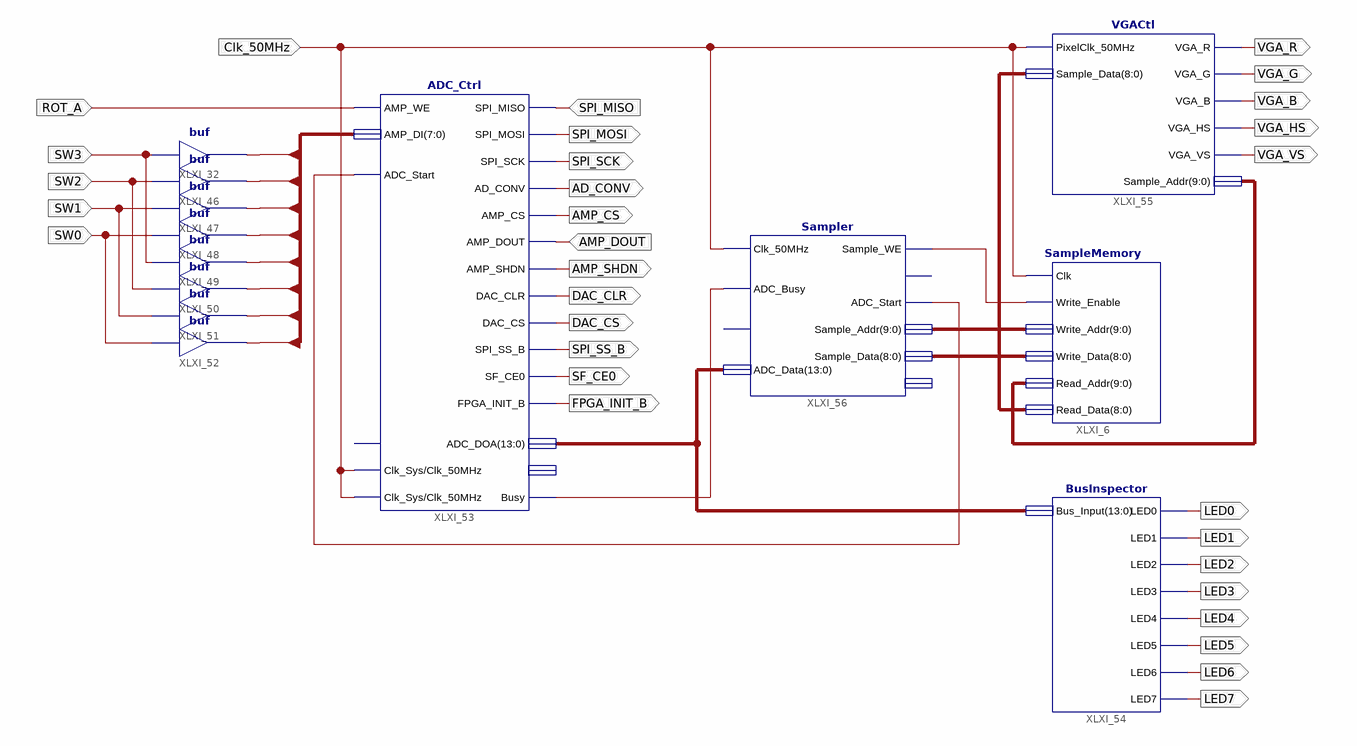
[diagram p0: schematic sheet 1]
// Xilinx ISE schematic Oscilloscope.sch (spartan3e) as structural Verilog: 13 symbols, 31 ports
module Oscilloscope (
  input  Clk_50MHz,
  input  AMP_DOUT,
  input  ROT_A,
  input  SW3,
  input  SW0,
  input  SW1,
  input  SW2,
  input  SPI_MISO,
  output SPI_MOSI,
  output SPI_SCK,
  output AD_CONV,
  output AMP_CS,
  output AMP_SHDN,
  output DAC_CLR,
  output DAC_CS,
  output SPI_SS_B,
  output FPGA_INIT_B,
  output SF_CE0,
  output LED7,
  output LED6,
  output LED5,
  output LED4,
  output LED3,
  output LED2,
  output LED1,
  output LED0,
  output VGA_VS,
  output VGA_HS,
  output VGA_B,
  output VGA_G,
  output VGA_R
);

  wire XLXN_27, XLXN_51, XLXN_60;
  wire [7:0] XLXN_69;
  wire [8:0] XLXN_23, XLXN_25;
  wire [9:0] XLXN_24, XLXN_26;
  wire [13:0] XLXN_67;

  SampleMemory XLXI_6 (
    .Clk(Clk_50MHz), .Write_Enable(XLXN_27), .Write_Addr(XLXN_26), .Write_Data(XLXN_25), .Read_Addr(XLXN_24),
    .Read_Data(XLXN_23));
  buf XLXI_32 (XLXN_69[7], SW3);
  buf XLXI_46 (XLXN_69[6], SW2);
  buf XLXI_47 (XLXN_69[5], SW1);
  buf XLXI_48 (XLXN_69[4], SW0);
  buf XLXI_49 (XLXN_69[3], SW3);
  buf XLXI_50 (XLXN_69[2], SW2);
  buf XLXI_51 (XLXN_69[1], SW1);
  buf XLXI_52 (XLXN_69[0], SW0);
  ADC_Ctrl XLXI_53 (
    .Clk_Sys(Clk_50MHz), .AMP_WE(ROT_A), .ADC_Start(XLXN_51), .SPI_MISO(SPI_MISO), .AMP_DOUT(AMP_DOUT),
    .AMP_DI(XLXN_69), .Busy(XLXN_60), .SPI_MOSI(SPI_MOSI), .SPI_SCK(SPI_SCK), .AMP_CS(AMP_CS),
    .AMP_SHDN(AMP_SHDN), .AD_CONV(AD_CONV), .DAC_CS(DAC_CS), .DAC_CLR(DAC_CLR), .SPI_SS_B(SPI_SS_B),
    .SF_CE0(SF_CE0), .FPGA_INIT_B(FPGA_INIT_B), .ADC_DOA(XLXN_67), .Clk_50MHz(Clk_50MHz));  // open: ADC_DOB, Reset
  BusInspector XLXI_54 (
    .Bus_Input(XLXN_67), .LED0(LED0), .LED1(LED1), .LED2(LED2), .LED3(LED3), .LED4(LED4), .LED5(LED5),
    .LED6(LED6), .LED7(LED7));
  VGACtl XLXI_55 (
    .PixelClk_50MHz(Clk_50MHz), .Sample_Data(XLXN_23), .VGA_R(VGA_R), .VGA_G(VGA_G), .VGA_B(VGA_B),
    .VGA_HS(VGA_HS), .VGA_VS(VGA_VS), .Sample_Addr(XLXN_24));
  Sampler XLXI_56 (
    .Clk_50MHz(Clk_50MHz), .ADC_Busy(XLXN_60), .ADC_Data(XLXN_67), .Sample_WE(XLXN_27), .ADC_Start(XLXN_51),
    .Sample_Addr(XLXN_26), .Sample_Data(XLXN_25));  // open: Hold, AMP_WE, AMP_Data
endmodule
